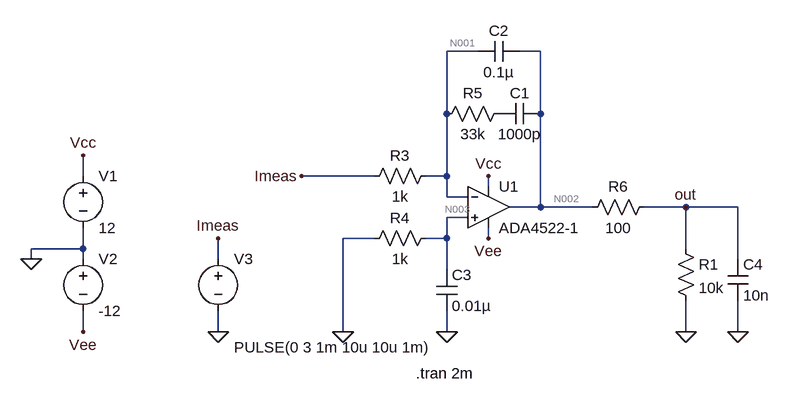
[diagram p0: schematic Controller.asc]
Controller.asc, the LTspice schematic file:
Version 4
SHEET 1 984 680
WIRE 528 -64 480 -64
WIRE 624 -64 592 -64
WIRE 480 32 480 -64
WIRE 624 32 624 -64
WIRE -80 128 -80 96
WIRE 368 128 256 128
WIRE 480 128 480 32
WIRE 480 128 448 128
WIRE 544 144 544 128
WIRE 480 160 480 128
WIRE 512 160 480 160
WIRE 624 176 624 32
WIRE 624 176 576 176
WIRE 704 176 624 176
WIRE 848 176 784 176
WIRE 928 176 848 176
WIRE 512 192 480 192
WIRE 368 224 320 224
WIRE 480 224 480 192
WIRE 480 224 448 224
WIRE 544 224 544 208
WIRE -80 240 -80 208
WIRE -80 240 -160 240
WIRE 848 240 848 176
WIRE -160 256 -160 240
WIRE -80 256 -80 240
WIRE 128 256 128 224
WIRE 928 256 928 176
WIRE 480 272 480 224
WIRE -80 368 -80 336
WIRE 128 368 128 336
WIRE 320 368 320 224
WIRE 480 368 480 336
WIRE 848 368 848 320
WIRE 928 368 928 320
FLAG 544 128 Vcc
FLAG 544 224 Vee
FLAG 480 368 0
FLAG -160 256 0
FLAG -80 96 Vcc
FLAG -80 368 Vee
FLAG 128 368 0
FLAG 128 224 Imeas
FLAG 256 128 Imeas
FLAG 928 368 0
FLAG 848 368 0
FLAG 320 368 0
FLAG 848 176 out
SYMBOL res 464 112 R90
WINDOW 0 0 56 VBottom 2
WINDOW 3 32 56 VTop 2
SYMATTR InstName R3
SYMATTR Value 1k
SYMBOL res 464 208 R90
WINDOW 0 0 56 VBottom 2
WINDOW 3 32 56 VTop 2
SYMATTR InstName R4
SYMATTR Value 1k
SYMBOL res 576 16 R90
WINDOW 0 0 56 VBottom 2
WINDOW 3 32 56 VTop 2
SYMATTR InstName R5
SYMATTR Value 33k
SYMBOL cap 624 16 R90
WINDOW 0 0 32 VBottom 2
WINDOW 3 32 32 VTop 2
SYMATTR InstName C1
SYMATTR Value 1000p
SYMBOL cap 592 -80 R90
WINDOW 0 0 32 VBottom 2
WINDOW 3 32 32 VTop 2
SYMATTR InstName C2
SYMATTR Value 0.1µ
SYMBOL cap 464 272 R0
SYMATTR InstName C3
SYMATTR Value 0.01µ
SYMBOL voltage -80 112 R0
WINDOW 123 0 0 Left 0
WINDOW 39 0 0 Left 0
SYMATTR InstName V1
SYMATTR Value 12
SYMBOL voltage -80 240 R0
WINDOW 123 0 0 Left 0
WINDOW 39 0 0 Left 0
SYMATTR InstName V2
SYMATTR Value -12
SYMBOL cap 912 256 R0
SYMATTR InstName C4
SYMATTR Value 10n
SYMBOL res 800 160 R90
WINDOW 0 0 56 VBottom 2
WINDOW 3 32 56 VTop 2
SYMATTR InstName R6
SYMATTR Value 100
SYMBOL OpAmps\\ADA4522-1 544 112 R0
SYMATTR InstName U1
SYMBOL res 832 224 R0
SYMATTR InstName R1
SYMATTR Value 10k
SYMBOL voltage 128 240 R0
WINDOW 3 24 152 Left 2
WINDOW 123 24 124 Left 2
WINDOW 39 0 0 Left 0
SYMATTR InstName V3
SYMATTR Value PULSE(0 3 1m 10u 10u 1m)
TEXT 432 432 Left 2 !.tran 2m

The netlist it stands for:
* Controller.asc
R3 N001 Imeas 1k
R4 N003 0 1k
R5 P001 N001 33k
C1 N002 P001 1000p
C2 N002 N001 0.1µ
C3 N003 0 0.01µ
V1 Vcc 0 12
V2 0 Vee -12
C4 out 0 10n
R6 out N002 100
XU1 N003 N001 Vcc Vee N002 ADA4522-1  ; pins In+ In- V+ V- OUT
R1 out 0 10k
V3 Imeas 0 PULSE(0 3 1m 10u 10u 1m)
.tran 2m
.backanno
.end

* Results of the author's LTspice run, read from the files saved beside the schematic
* Operating Point, zero values left out:
*   V(n001) = 88.41 nV
*   V(n003) = -48.43 nV
*   V(p001) = 88.41 nV
*   V(n002) = 11.96 V
*   V(vcc) = 12 V
*   V(vee) = 12 V
*   V(out) = 11.84 V
*   I(R1) = 1.184 mA
*   I(R6) = -1.184 mA
*   I(R4) = -48.43 pA
*   I(R3) = 88.41 pA
*   I(V3) = 88.41 pA
*   I(V2) = 249 mA
*   I(V1) = -2.024 mA
*   Ix(u1:1) = 48.43 pA
*   Ix(u1:2) = -88.41 pA
*   Ix(u1:3) = 2.024 mA
*   Ix(u1:4) = 249 mA
*   Ix(u1:5) = -1.184 mA
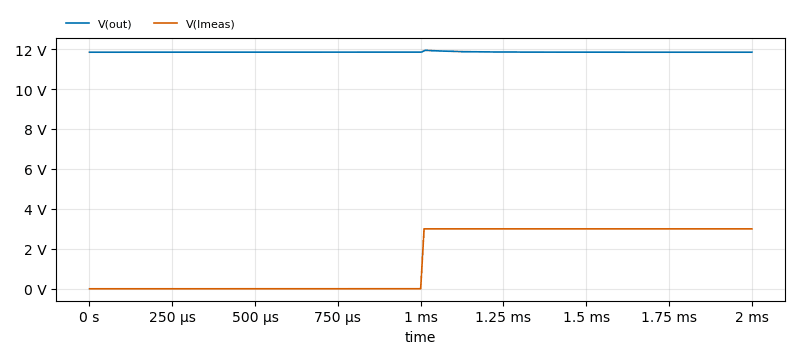
[diagram p1: Transient Analysis of Controller.asc, plotted from the saved traces]
* Transient Analysis, 1 run:
*   V(out): min 11.84 V, max 11.93 V, average 11.85 V, rms 11.85 V, last 11.84 V
*   V(Imeas): min 0 V, max 3 V, average 1.493 V, rms 2.114 V, last 3 V